# Altium schematic sheet -5BuckConverter.SchDoc
size A; SheetNumber: 3; SheetTotal: 3
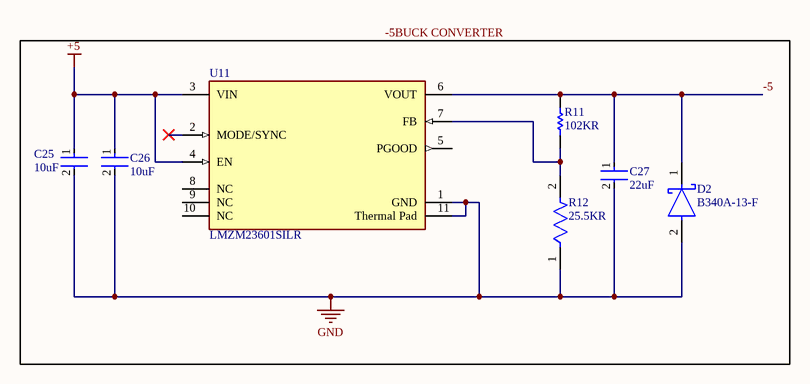
[diagram p0: -5BuckConverter.SchDoc]

## Parts
C25  10uF  [FP-C1608-080-IPC_A]
C26  10uF  [FP-C1608-080-IPC_A]
C27  22uF  [FP-GRM21B-0_2-e0_2_0_7-IPC_C]
D2  B340A-13-F  [FP-SMA-MFG]
R11  102KR  [RESC1005X40X25ML05T05]
R12  25.5KR  [FP-CRCW0402-e3-IPC_A]
U11  LMZM23601SILR  [FP-SIL0010A-MFG]

## Nets
+5: C25.1 C26.1 U11.3(VIN) U11.4(EN)
GND: C25.2 C26.2 C27.2 D2.2(A) R12.1 U11.1(GND) U11.11(Thermal_Pad)
-5: C27.1 D2.1(C) R11.2 U11.6(VOUT)
NetR11_1: R11.1 R12.2 U11.7(FB)

Not connected (* = marked no-connect by the designer): U11 2(MODE/SYNC)* 5(PGOOD) 8(NC) 9(NC) 10(NC)

## Notes on the sheet
- Labels drawn without touching a wire or pin: -5BUCK CONVERTER

## Library data of the parts
C25 C26 = CMP-2000-05442-2: CAP CER 10UF 25V X5R 0603; Dielectric Material: Ceramic; Tolerance: 20%; Dielectric: X5R; Length: 1.6mm; Termination: SMD/SMT; Depth: 0.8mm; RoHS Compliant: Yes; Construction: Flat; Weight: 7.1E-05oz; Thickness: 0.039inch; Packaging: Tape and Reel; Min Operating Temperature: -55°C; Case Code (Imperial): 0603; Case/Package: 0603; Height: 0.8mm; Case Code (Metric): 1608; Voltage Rating: 25V; Resistor Type: Ceramic; Voltage Rating (DC): 25V; Max Operating Temperature: 85°C; REACH SVHC: No SVHC; Lead Free: Lead Free; Series: C; Width: 0.8mm; Mount: Surface Mount; Package Quantity: 1; Capacitance: 10uF
C27 = CMP-06035-039918-1: Chip Multilayer Ceramic Capacitors for General Purpose, 0805, 22uF, X5R, 15%, 20%, 10V; Dissipation Factor: 0.035%; Min Operating Temperature: -55°C; Voltage Rating (DC): 10V; Height: 1.25mm; Depth: 1.25mm; Max Operating Temperature: 85°C; Width: 1.25mm; Lead Free: Lead Free; Dielectric Material: Ceramic; Weight: 0.000335oz; Tolerance: 20%; Voltage Rating: 10V; Case Code (Metric): 2012; Termination: SMD/SMT; Length: 2mm; Thickness: 0.057inch; Case/Package: 0805; Packaging: Tape and Reel; Voltage: 10V; Case Code (Imperial): 0805; Resistor Type: Ceramic; Package Quantity: 3000; Mount: Surface Mount; Capacitance: 22uF; Dielectric: X5R
D2 = CMP-1667-00003-3: DIODE SCHOTTKY 40V 3A SMA; Max Forward Surge Current (Ifsm): 80A; Forward Voltage: 500mV; Polarity: Standard; Max Reverse Current: 500uA; Capacitance: 250pF; Element Configuration: Single; Mount: Surface Mount; Output Current: 3A; Radiation Hardening: No; Width: 2.92mm; Current Rating: 3A; Termination: SMD/SMT; Voltage: 40V; Series: -; Max Operating Temperature: 125°C; Current: 3A; Max Repetitive Reverse Voltage (Vrrm): 40V; Min Operating Temperature: -55°C; REACH SVHC: No SVHC; Number of Pins: 2; Average Rectified Current: 3A; Contact Plating: Tin; RoHS Compliant: Yes; Max Reverse Voltage (DC): 40V; Packaging: Tape and Reel; Height: 2.3mm; Length: 4.6mm; Case/Package: SMA; Weight: 0.002258oz; Peak Non-Repetitive Surge Current: 80A; Package Quantity: 5000; Lead Free: Lead Free; Forward Current: 3A; Voltage Rating (DC): 40V
R11 = CMP-1011-00737-2: Manufacturer: Vishay Dale; Part Number: CRCW0402102KFKED
R12 = CMP-2002-08416-2: RES Thick Film, 25.5kΩ, 1%, 0.063W, 100ppm/°C, 0402; Power Rating: 63mW; Voltage Rating: 50V; Resistance: 25.5kR; Number of Terminations: 2; Length: 1mm; Height: 0.35mm; Termination: SMD/SMT; Radiation Hardening: No; Min Operating Temperature: -55°C; Lead Free: Lead Free; Number of Pins: 2; Mount: Surface Mount; Temperature Coefficient: 100ppm/°C; Weight: 2.3E-05oz; Composition: Thick Film; Depth: 0.5mm; Tolerance: 1%; Width: 0.5mm; Contact Plating: Tin; Features: Automotive AEC-Q200; Max Operating Temperature: 155°C; Case Code (Metric): 1005; Military Standard: Not; Packaging: Tape and Reel; Voltage Rating (DC): 50V; Package Quantity: 10; Case/Package: 0402; Max Power Dissipation: 63mW; Case Code (Imperial): 0402
U11 = CMP-04918-000359-1: DC DC CONVERTER 1.2-15V; Min Input Voltage: 4V; Voltage - Output 1: 15V; Max Input Voltage: 36V; Number of Outputs: 1; Max Output Current: 1A; Mount: Surface Mount; Features: UVLO; Min Operating Temperature: -40°C; RoHS Compliant: Yes; Max Operating Temperature: 125°C